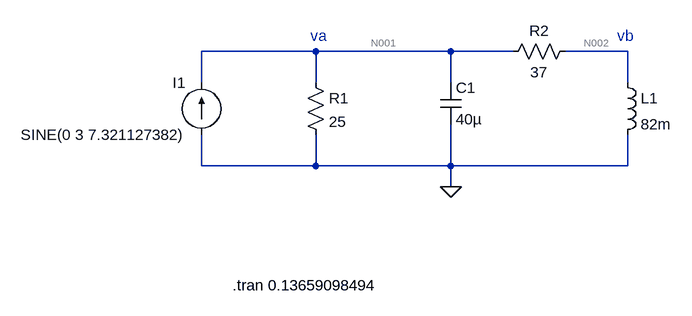
[diagram p0: schematic Q4 a1.asc]
Q4 a1.asc, the LTspice schematic file:
Version 4.1
SHEET 1 880 680
WIRE 160 64 -16 64
WIRE 368 64 160 64
WIRE 464 64 368 64
WIRE 640 64 544 64
WIRE -16 112 -16 64
WIRE 160 112 160 64
WIRE 368 112 368 64
WIRE 640 112 640 64
WIRE -16 240 -16 192
WIRE 160 240 160 192
WIRE 160 240 -16 240
WIRE 368 240 368 176
WIRE 368 240 160 240
WIRE 640 240 640 192
WIRE 640 240 368 240
WIRE 368 272 368 240
FLAG 368 272 0
SYMBOL current -16 192 R180
WINDOW 0 24 80 Left 2
WINDOW 3 24 0 Left 2
WINDOW 123 0 0 Left 0
WINDOW 39 0 0 Left 0
SYMATTR InstName I1
SYMATTR Value SINE(0 3 7.321127382)
SYMBOL res 144 96 R0
SYMATTR InstName R1
SYMATTR Value 25
SYMBOL res 560 48 R90
WINDOW 0 0 56 VBottom 2
WINDOW 3 32 56 VTop 2
SYMATTR InstName R2
SYMATTR Value 37
SYMBOL cap 352 112 R0
SYMATTR InstName C1
SYMATTR Value 40µ
SYMBOL ind 624 96 R0
SYMATTR InstName L1
SYMATTR Value 82m
TEXT 152 40 Left 2 ;va
TEXT 624 40 Left 2 ;vb
TEXT 32 424 Left 2 !.tran 0.13659098494

The netlist it stands for:
* Q4 a1.asc
I1 0 N001 SINE(0 3 7.321127382)
R1 N001 0 25
R2 N002 N001 37
C1 N001 0 40µ
L1 N002 0 82m
* va
* vb
.tran 0.13659098494
.backanno
.end

* Results of the author's LTspice run, read from the files saved beside the schematic
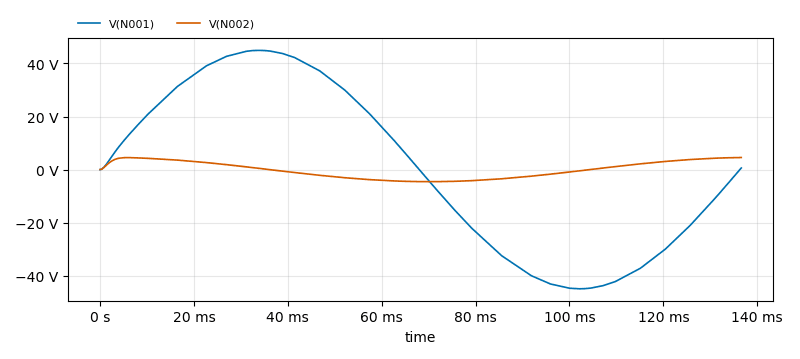
[diagram p1: Transient Analysis of Q4 a1.asc, plotted from the saved traces]
* Transient Analysis, 1 run:
*   V(N001): min -44.94 V, max 44.94 V, average -25.8 mV, rms 31.77 V, last 597 mV
*   V(N002): min -4.558 V, max 4.54 V, average -63.6 mV, rms 3.163 V, last 4.54 V